# Altium schematic sheet Flash Memory.SchDoc
size A; SheetNumber: 9; SheetTotal: 9
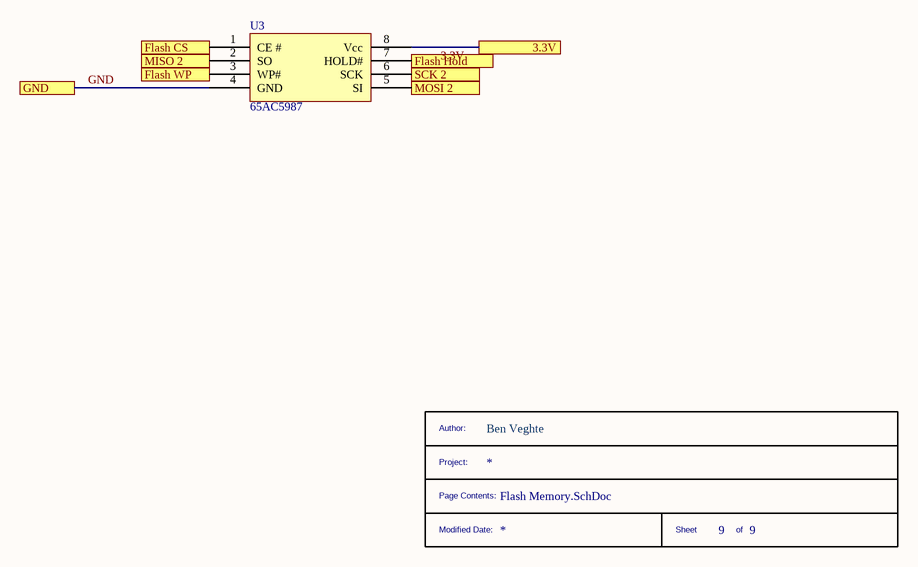
[diagram p0: Flash Memory.SchDoc]

## Parts
*  __TITLE_BLOCK__  (value not drawn)  (graphical)
U3  Supplier Part Number 1: 65AC5987  [IS25LQ020B-JNLE]  (hidden comment: IS25LQ020B-JNLE)

## Ports
3.3V, Flash CS, Flash Hold, Flash WP, GND, MISO 2, MOSI 2, SCK 2

## Nets
3.3V: U3.8(Vcc) ; port 3.3V
Flash CS: U3.1(CE_#) ; port Flash CS
Flash Hold: U3.7(HOLD#) ; port Flash Hold
Flash WP: U3.3(WP#) ; port Flash WP
GND: U3.4(GND) ; port GND
MISO 2: U3.2(SO) ; port MISO 2
MOSI 2: U3.5(SI) ; port MOSI 2
SCK 2: U3.6(SCK) ; port SCK 2

## Notes on the sheet
- (in symbol __TITLE_BLOCK__) Author:; Ben Veghte; Project:; Page Contents:; Modified Date:; Sheet; of

## Library data of the parts
U3 = IS25LQ020B-JNLE: NOR Flash Serial (SPI, Dual SPI, Quad SPI) 2.5V/3V/3.3V 2M-bit 256K x 8 8ns 8-Pin SOIC N; Manufacturer: ISSI; Memory Type: FLASH,NOR; Frequency: 104MHz; Interface: SPI,Serial; Density: 2Mb; Operating Supply Voltage: 3.3V; Address Bus Width: 24b; Page Size: 256B; Min Supply Voltage: 2.3V; Max Supply Voltage: 3.6V; Supplier 1: Newark; Manufacturer Part Number: IS25LQ020B-JNLE; RoHS: Yes; Category: Memory; Stock 1: 799; Pricing 1: 1=0.45200, 10=0.41800, 100=0.37600, 500=0.35200 (USD); Mount: Surface Mount; Case/Package: SOIC; Number of Pins: 8; Min Operating Temperature: -40°C; Max Operating Temperature: 105°C; Packaging: Bulk; Access Time: 8ns; RoHS Compliant: Yes; ComponentLink1URL: http://www.mouser.com/ds/2/198/25LQ025B-512B-010B-020B-040B-706473.pdf?src-supplier=Mouser; ComponentLink1Description: http://www.mouser.com/ds/2/198/25LQ025B-512B-010B-020B-040B-706473.pdf?src-supplier=Mouser; ComponentLink2URL: http://www.issi.com/WW/pdf/25LQ025B-512B-010B-020B-040B.pdf?src-supplier=Avnet; ComponentLink2Description: http://www.issi.com/WW/pdf/25LQ025B-512B-010B-020B-040B.pdf?src-supplier=Avnet; ComponentLink3URL: http://www.issi.com/WW/pdf/25LQ025B-512B-010B-020B-040B.pdf?src-supplier=Digi-Key; ComponentLink3Description: http://www.issi.com/WW/pdf/25LQ025B-512B-010B-020B-040B.pdf?src-supplier=Digi-Key; ComponentLink4URL: http://www.farnell.com/datasheets/2625712.pdf?src-supplier=Newark; ComponentLink4Description: http://www.farnell.com/datasheets/2625712.pdf?src-supplier=Newark